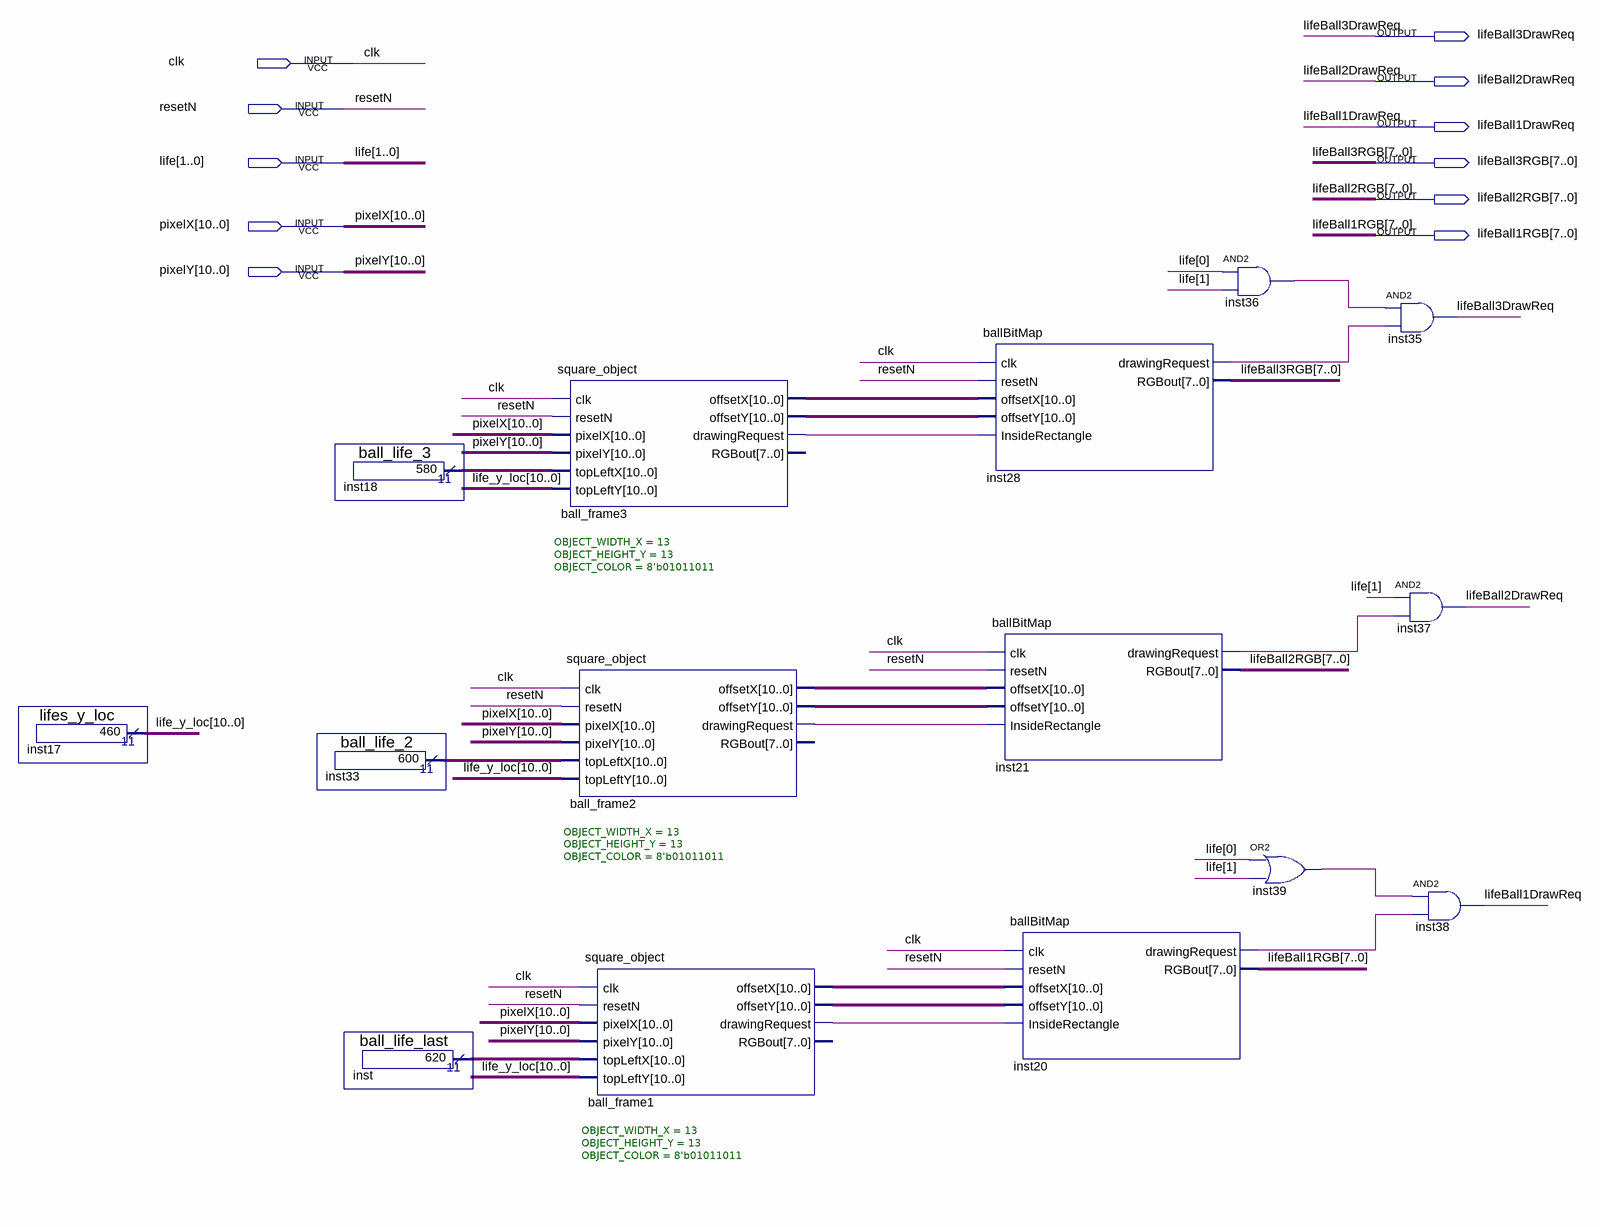
[diagram p0: schematic sheet]
// Quartus schematic lifeDisplay.bdf as structural Verilog: 15 symbols, 11 pins
module lifeDisplay (
  input  clk,
  input  resetN,
  input  [1:0] life,
  input  [10:0] pixelX,
  input  [10:0] pixelY,
  output lifeBall3DrawReq,
  output lifeBall2DrawReq,
  output lifeBall1DrawReq,
  output [7:0] lifeBall3RGB,
  output [7:0] lifeBall2RGB,
  output [7:0] lifeBall1RGB
);

  wire ball_frame1_drawingrequest, ball_frame2_drawingrequest, ball_frame3_drawingrequest,
       inst20_drawingrequest, inst21_drawingrequest, inst28_drawingrequest, inst36_out, inst39_out;
  wire [10:0] ball_frame1_offsetx, ball_frame1_offsety, ball_frame2_offsetx, ball_frame2_offsety,
       ball_frame3_offsetx, ball_frame3_offsety, inst18_result, inst33_result, inst_result, life_y_loc;

  lifes_y_loc inst17 (.result(life_y_loc));
  ball_life_3 inst18 (.result(inst18_result));
  ball_life_2 inst33 (.result(inst33_result));
  ball_life_last inst (.result(inst_result));
  square_object #(.OBJECT_WIDTH_X(13), .OBJECT_HEIGHT_Y(13), .OBJECT_COLOR(8'b01011011)) ball_frame3 (
    .clk(clk), .resetN(resetN), .pixelX(pixelX), .pixelY(pixelY), .topLeftX(inst18_result),
    .topLeftY(life_y_loc), .offsetX(ball_frame3_offsetx), .offsetY(ball_frame3_offsety),
    .drawingRequest(ball_frame3_drawingrequest));  // open: RGBout
  square_object #(.OBJECT_WIDTH_X(13), .OBJECT_HEIGHT_Y(13), .OBJECT_COLOR(8'b01011011)) ball_frame2 (
    .clk(clk), .resetN(resetN), .pixelX(pixelX), .pixelY(pixelY), .topLeftX(inst33_result),
    .topLeftY(life_y_loc), .offsetX(ball_frame2_offsetx), .offsetY(ball_frame2_offsety),
    .drawingRequest(ball_frame2_drawingrequest));  // open: RGBout
  square_object #(.OBJECT_WIDTH_X(13), .OBJECT_HEIGHT_Y(13), .OBJECT_COLOR(8'b01011011)) ball_frame1 (
    .clk(clk), .resetN(resetN), .pixelX(pixelX), .pixelY(pixelY), .topLeftX(inst_result),
    .topLeftY(life_y_loc), .offsetX(ball_frame1_offsetx), .offsetY(ball_frame1_offsety),
    .drawingRequest(ball_frame1_drawingrequest));  // open: RGBout
  ballBitMap inst28 (
    .clk(clk), .resetN(resetN), .offsetX(ball_frame3_offsetx), .offsetY(ball_frame3_offsety),
    .InsideRectangle(ball_frame3_drawingrequest), .drawingRequest(inst28_drawingrequest),
    .RGBout(lifeBall3RGB));
  ballBitMap inst21 (
    .clk(clk), .resetN(resetN), .offsetX(ball_frame2_offsetx), .offsetY(ball_frame2_offsety),
    .InsideRectangle(ball_frame2_drawingrequest), .drawingRequest(inst21_drawingrequest),
    .RGBout(lifeBall2RGB));
  ballBitMap inst20 (
    .clk(clk), .resetN(resetN), .offsetX(ball_frame1_offsetx), .offsetY(ball_frame1_offsety),
    .InsideRectangle(ball_frame1_drawingrequest), .drawingRequest(inst20_drawingrequest),
    .RGBout(lifeBall1RGB));
  and inst36 (inst36_out, life[0], life[1]);
  or inst39 (inst39_out, life[0], life[1]);
  and inst35 (lifeBall3DrawReq, inst36_out, inst28_drawingrequest);
  and inst37 (lifeBall2DrawReq, life[1], inst21_drawingrequest);
  and inst38 (lifeBall1DrawReq, inst39_out, inst20_drawingrequest);
endmodule
